# EAGLE design rc-light-controller-tlc5940-lpc812 (EAGLE 6.5.0)
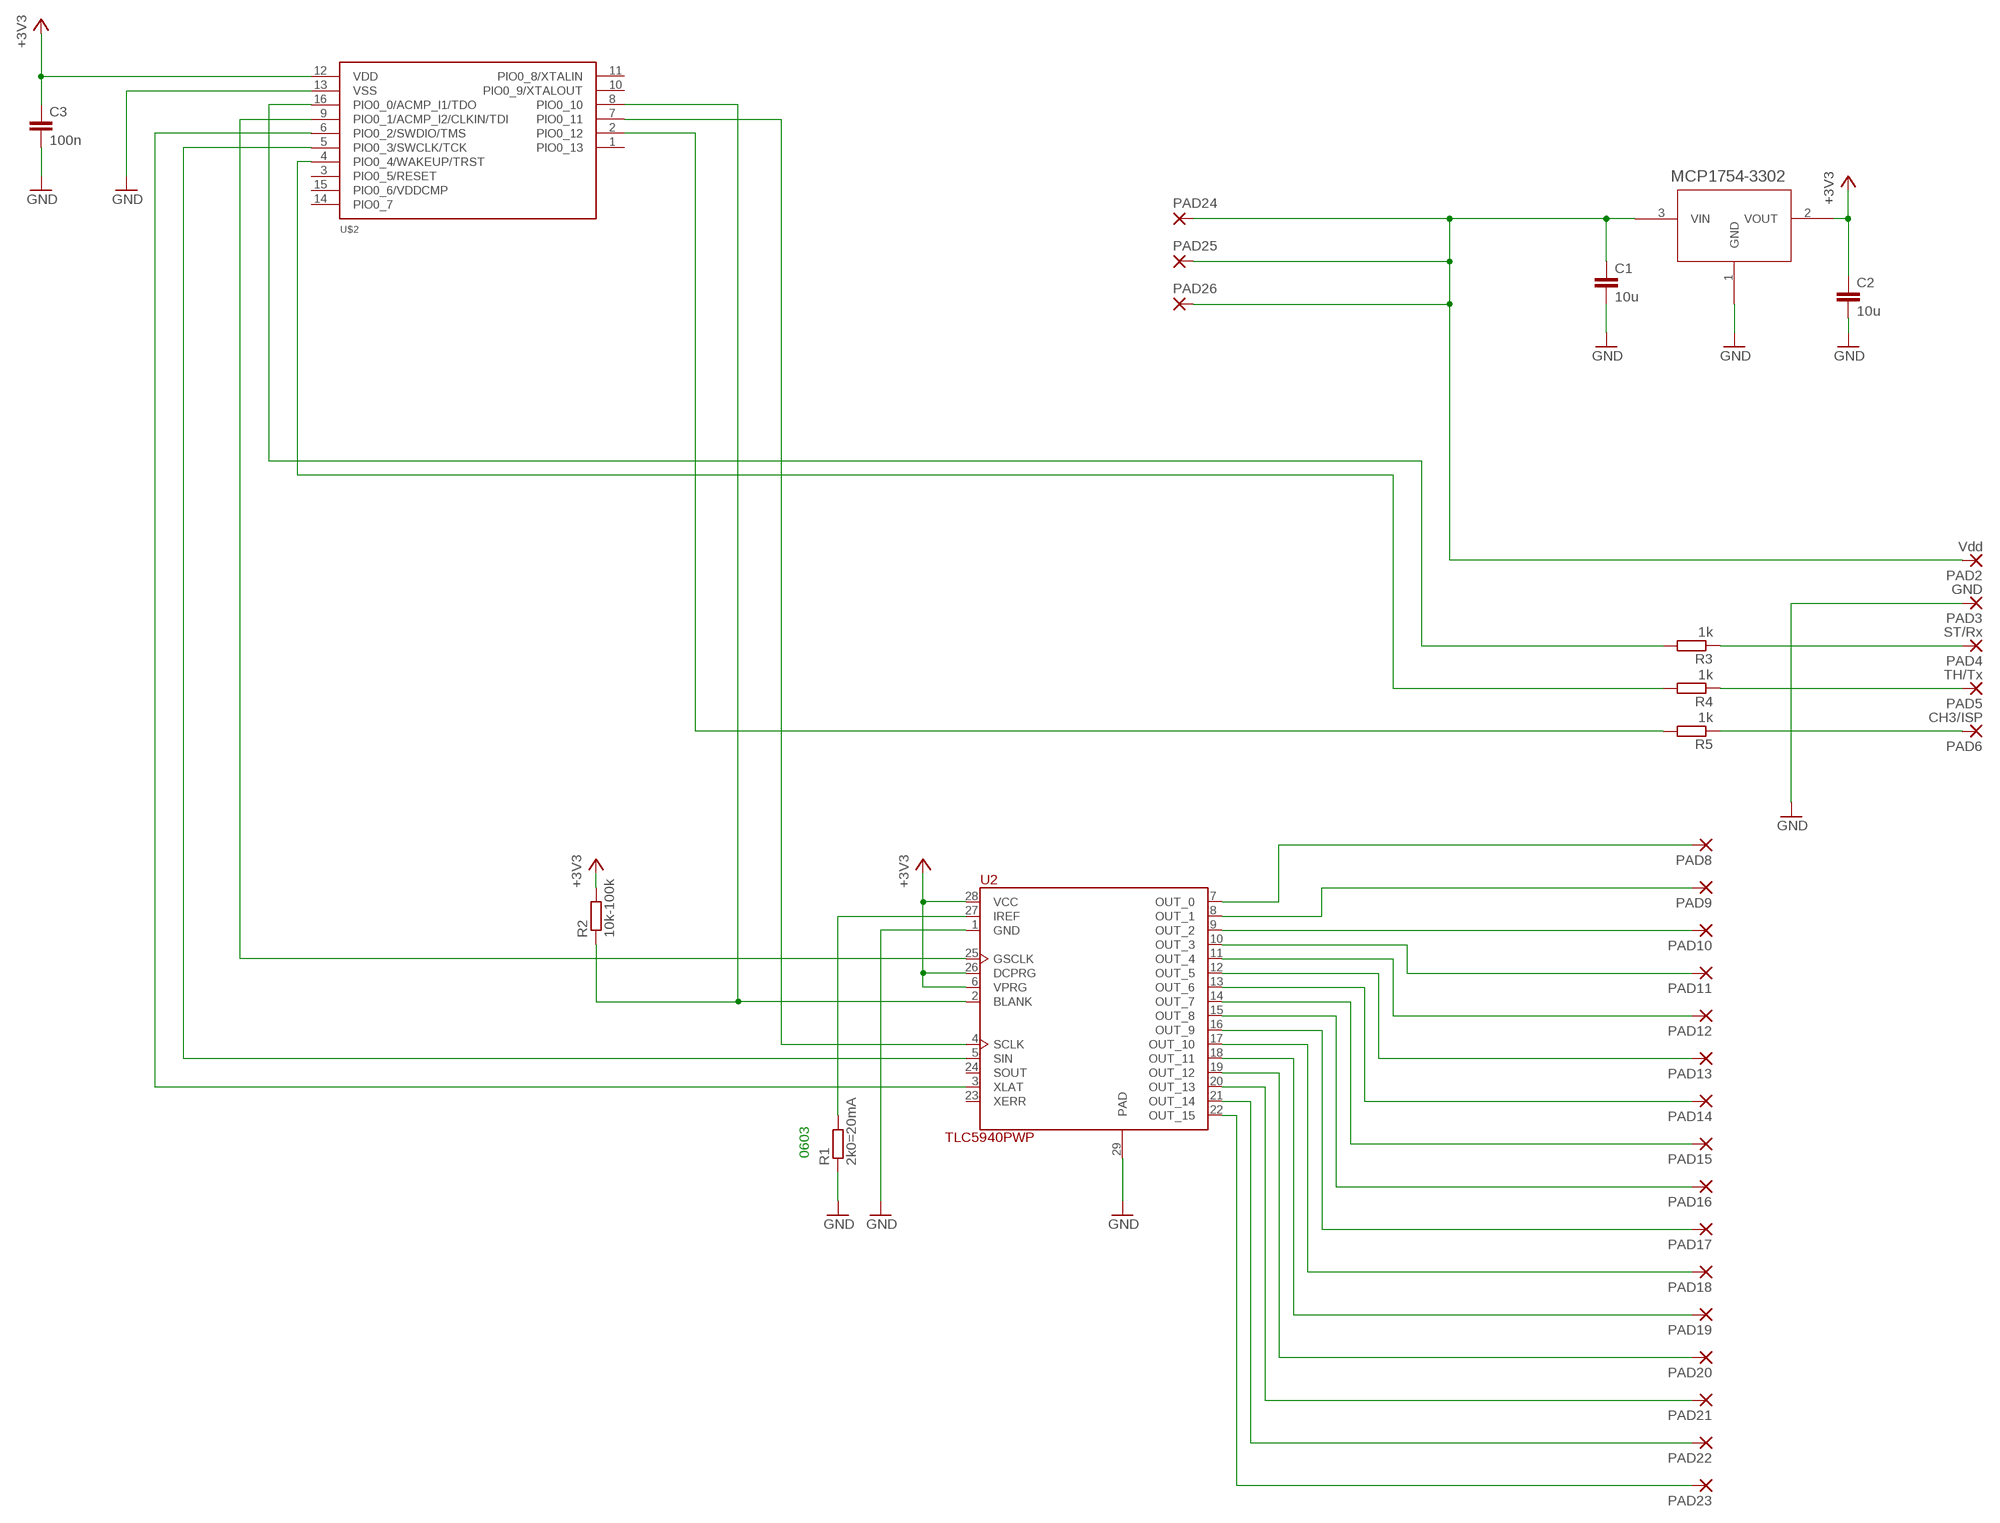
[diagram p0: schematic, sheet 1]

## Parts
C1  10u  C-EUC0805  [C0805]
C2  10u  C-EUC0805  [C0805]
C3  100n  C-EUC0805  [C0805]
PAD2  Vdd  SDM80X120  [SMD80X120]
PAD3  GND  SDM80X120  [SMD80X120]
PAD4  ST/Rx  SDM80X120  [SMD80X120]
PAD5  TH/Tx  SDM80X120  [SMD80X120]
PAD6  CH3/ISP  SDM80X120  [SMD80X120]
PAD8  SMD50X100  [SMD50X100]
PAD9  SMD50X100  [SMD50X100]
PAD10  SMD50X100  [SMD50X100]
PAD11  SMD50X100  [SMD50X100]
PAD12  SMD50X100  [SMD50X100]
PAD13  SMD50X100  [SMD50X100]
PAD14  SMD50X100  [SMD50X100]
PAD15  SMD50X100  [SMD50X100]
PAD16  SMD50X100  [SMD50X100]
PAD17  SMD50X100  [SMD50X100]
PAD18  SMD50X100  [SMD50X100]
PAD19  SMD50X100  [SMD50X100]
PAD20  SMD50X100  [SMD50X100]
PAD21  SMD50X100  [SMD50X100]
PAD22  SMD50X100  [SMD50X100]
PAD23  SMD50X100  [SMD50X100]
PAD24  SMD50X100  [SMD50X100]
PAD25  SMD50X100  [SMD50X100]
PAD26  SMD50X100  [SMD50X100]
R1  2k0=20mA  R-EU_R0805  [R0805]
R2  10k-100k  R-EU_R0805  [R0805]
R3  1k  R-EU_R0805  [R0805]
R4  1k  R-EU_R0805  [R0805]
R5  1k  R-EU_R0805  [R0805]
U2  TLC5940PWP  [SOP65P640X120-29N]
U$1  MCP1754X-XXXXX/C  [SOT-23A_MC]
U$2  LPC812  LPC812M101JDH16  [TSSOP16]

## Nets
+3V3: C2.1 C3.1 R2.2 U2.6(VPRG) U2.26(DCPRG) U2.28(VCC) U$1.2(VOUT) U$2.12(VDD)
BLANK: R2.1 U2.2(BLANK) U$2.8(PIO0_10)
GND: C1.2 C2.2 C3.2 PAD3.1(P) R1.1 U2.1(GND) U2.29(PAD) U$1.1(GND) U$2.13(VSS)
GSCLK: U2.25(GSCLK) U$2.9(PIO0_1/ACMP_I2/CLKIN/TDI)
IREF: R1.2 U2.27(IREF)
N$17: PAD4.1(P) R3.1
N$18: PAD5.1(P) R4.1
N$19: PAD6.1(P) R5.1
N$20: R5.2 U$2.2(PIO0_12)
OUT0: PAD8.1(P) U2.7(OUT_0)
OUT1: PAD9.1(P) U2.8(OUT_1)
OUT2: PAD10.1(P) U2.9(OUT_2)
OUT3: PAD11.1(P) U2.10(OUT_3)
OUT4: PAD12.1(P) U2.11(OUT_4)
OUT5: PAD13.1(P) U2.12(OUT_5)
OUT6: PAD14.1(P) U2.13(OUT_6)
OUT7: PAD15.1(P) U2.14(OUT_7)
OUT8: PAD16.1(P) U2.15(OUT_8)
OUT9: PAD17.1(P) U2.16(OUT_9)
OUT10: PAD18.1(P) U2.17(OUT_10)
OUT11: PAD19.1(P) U2.18(OUT_11)
OUT12: PAD20.1(P) U2.19(OUT_12)
OUT13: PAD21.1(P) U2.20(OUT_13)
OUT14: PAD22.1(P) U2.21(OUT_14)
OUT15: PAD23.1(P) U2.22(OUT_15)
SCLK: U2.4(SCLK) U$2.7(PIO0_11)
SIN: U2.5(SIN) U$2.5(PIO0_3/SWCLK/TCK)
SLAT: U2.3(XLAT) U$2.6(PIO0_2/SWDIO/TMS)
ST/CLK/RX: R4.2 U$2.4(PIO0_4/WAKEUP/TRST)
TH/DAT/TX: R3.2 U$2.16(PIO0_0/ACMP_I1/TDO)
VIN: C1.1 PAD2.1(P) PAD24.1(P) PAD25.1(P) PAD26.1(P) U$1.3(VIN)
Unconnected: U2.23(XERR) U2.24(SOUT) U$2.1(PIO0_13) U$2.3(PIO0_5/RESET) U$2.10(PIO0_9/XTALOUT) U$2.11(PIO0_8/XTALIN) U$2.14(PIO0_7) U$2.15(PIO0_6/VDDCMP)

## Notes on the sheet
- 0603

## Library data of the parts
C1-C3 = rcl:C-EU: CAPACITOR, European symbol
PAD2-PAD6 = wirepad:SDM80X120
PAD8-PAD26 = wirepad:SMD50X100: SMD PAD
R1-R5 = rcl:R-EU_: RESISTOR, European symbol
U2 = tlc5940:TLC5940: 16 CHANNEL LED DRIVER WITH DOT CORRECTION AND GRAYSCALE PWM CONTROL; MPN: TLC5940PWP; PACKAGE: HTSSOP-28; SUPPLIER: Texas Instruments
U$1 = MCP1754:MCP1754X-XXXXX/C
U$2 = LPC800:LPC812M101JDH16

## Board
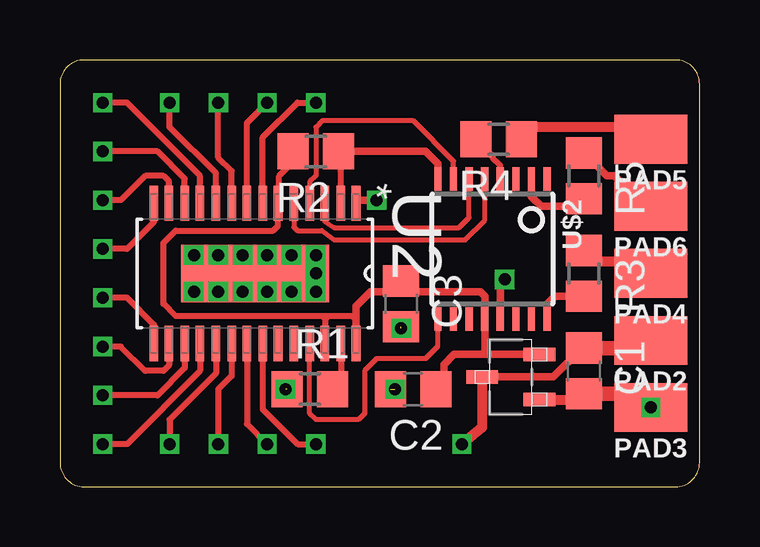
[diagram p1: board, top side]
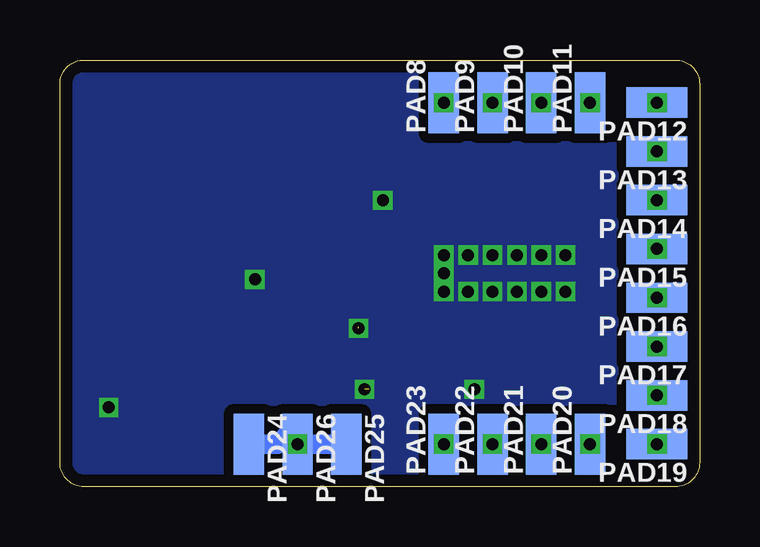
[diagram p2: board, bottom side, seen from below]

Size 26.67 x 17.78 mm. Coordinates in mm from the lower left corner, seen from the top.
Outline: 1,0 25.67,0 arc90 26.67,1 26.67,16.78 arc90 25.67,17.78 1,17.78 arc90 0,16.78 0,1 arc90 1,0
Copper layers (1*16): Top 0.035mm / dielectric 1.5mm / Bottom 0.035mm
Design rules "smart-prototyping": minimum track width 7mil, minimum drill 12mil, track to track 7mil, track to pad 7mil, pad to pad 7mil, via to via 7mil, smd to smd 0mil, copper to edge 20mil, drill to drill 10mil, minimum pad ring 10mil, minimum via ring 6mil, stop-mask expansion 2mil, vias tented up to drill 25mil, thermal gap 10mil

### Footprints (pad centres in the part's own frame; a part is rotated, then mirrored left to right if it is on the bottom)
C0805 = smd 1.3 x 1.5: 1 -0.95,0; 2 0.95,0
SMD80X120 = smd 2.032 x 3.048: 1 0,0
SMD50X100 = smd 1.27 x 2.54: 1 0,0
R0805 = smd 1.3 x 1.5: 1 -0.95,0; 2 0.95,0
SOP65P640X120-29N = smd 1.473 x 0.356: 1 -2.921,4.216; 2 -2.921,3.581; 3 -2.921,2.921; 4 -2.921,2.286; 5 -2.921,1.626; 6 -2.921,0.965; 7 -2.921,0.33; 8 -2.921,-0.33; 9 -2.921,-0.965; 10 -2.921,-1.626; 11 -2.921,-2.286; 12 -2.921,-2.921; 13 -2.921,-3.581; 14 -2.921,-4.216; 15 2.921,-4.216; 16 2.921,-3.581; 17 2.921,-2.921; 18 2.921,-2.286; 19 2.921,-1.626; 20 2.921,-0.965; 21 2.921,-0.33; 22 2.921,0.33; 23 2.921,0.965; 24 2.921,1.626; 25 2.921,2.286; 26 2.921,2.921; 27 2.921,3.581; 28 2.921,4.216 | smd 2.388 x 6.172: 29 0,0
SOT-23A_MC = smd 0.559 x 1.321: 1 -0.94,-1.194; 2 0.94,-1.194; 3 0,1.194
TSSOP16 = smd 0.305 x 0.991: 1 -2.275,-2.918; 2 -1.625,-2.918; 3 -0.975,-2.918; 4 -0.325,-2.918; 5 0.325,-2.918; 6 0.975,-2.918; 7 1.625,-2.918; 8 2.275,-2.918; 9 2.275,2.918; 10 1.625,2.918; 11 0.975,2.918; 12 0.325,2.918; 13 -0.325,2.918; 14 -0.975,2.918; 15 -1.625,2.918; 16 -2.275,2.918

### Placement (x,y rotation side)
C1  21.84,4.83 270 top
C2  14.73,4.06 180 top
C3  14.22,7.62 270 top
PAD2  24.64,6.1 90 top
PAD3  24.64,3.3 90 top
PAD4  24.64,8.89 90 top
PAD5  24.64,14.48 90 top
PAD6  24.64,11.68 90 top
PAD8  10.67,16 0 bottom
PAD9  8.64,16 0 bottom
PAD10  6.6,16 0 bottom
PAD11  4.57,16 0 bottom
PAD12  1.78,16 90 bottom
PAD13  1.78,13.97 90 bottom
PAD14  1.78,11.94 90 bottom
PAD15  1.78,9.91 90 bottom
PAD16  1.78,7.87 90 bottom
PAD17  1.78,5.84 90 bottom
PAD18  1.78,3.81 90 bottom
PAD19  1.78,1.78 90 bottom
PAD20  4.57,1.78 0 bottom
PAD21  6.6,1.78 0 bottom
PAD22  8.64,1.78 0 bottom
PAD23  10.67,1.78 0 bottom
PAD24  18.8,1.78 180 bottom
PAD25  14.73,1.78 180 bottom
PAD26  16.76,1.78 180 bottom
R1  10.41,4.06 0 top
R2  10.67,13.97 180 top
R3  21.84,8.89 270 top
R4  18.29,14.48 180 top
R5  21.84,12.95 270 top
U2  8.13,8.89 270 top
U$1  18.8,4.57 90 top
U$2  18.03,9.91 180 top

### Tracks (layer width: path | path; a pad name or v marks a point on that pad's centre or on a via)
+3V3
  Top 0.254: U2.28 12.34,6.96 12.19,7.11 11.18,7.11 | 11.18,7.11 11.05,6.99 U2.26 | 11.18,7.11 4.83,7.11 4.32,7.62 4.32,10.16 4.83,10.67 8.89,10.67 9.09,10.87 U2.6 9.14,11.86 9.14,12.95 9.97,13.78 R2.2
  Top 0.305: 13.78,8.13 12.95,8.13 12.34,7.52 U2.28 | U$1.2 17.78,5.51 | 17.78,5.51 16.43,5.51 16,5.08 16,4.38 C2.1 | 17.78,5.51 17.71,5.58 U$2.12 17.71,7.95 17.53,8.13 13.78,8.13 | 13.78,8.13 C3.1
BLANK
  Top 0.254: U2.2 11.71,13.42 R2.1
  Top 0.305: U$2.8 15.76,13.45 15.24,13.97 R2.1
GND  (via drill 0.5)  (3 unrouted)
  Top 0.305: U2.1 12.47,11.94 v13.21,11.94 | U$2.13 18.36,8.45 v18.54,8.64 | v7.62,8.13 8.13,8.64 U2.29
  Top 0.406: U$1.1 21.83,3.63 C1.2
  Top 0.61: C1.2 24.06,3.88 PAD3.1
  Top 0.813: 24.32,3.62 PAD3.1
  other vias: 24.64,3.3 8.64,9.65 9.65,9.65 5.59,9.65 6.6,9.65 9.4,4.06 13.97,4.06 14.22,6.6 7.62,9.65 10.67,9.65 10.67,8.89 10.67,8.13 9.65,8.13 8.64,8.13 6.6,8.13 5.59,8.13
  pour Bottom (isolate 0.406): 0,17.78 26.67,17.78 26.67,0 0,0
GSCLK
  Top 0.203: U$2.9 15.75,5.96 15.75,5.84 15.24,5.33 13.21,5.33 12.7,4.83 12.7,3.05 12.45,2.79 10.67,2.79 10.41,3.05 U2.25
IREF
  Top 0.254: U2.27 11.71,4.11 R1.2
N$17
  Top 0.305: R3.1 22.29,9.4 | 24.38,9.4 24.64,9.14 PAD4.1
  Top 0.406: 22.29,9.4 24.38,9.4
N$18
  Top 0.254: 19.49,14.99 R4.1
  Top 0.305: 24.38,14.99 PAD5.1
  Top 0.406: 24.38,14.99 19.49,14.99
N$19
  Top 0.305: R5.1 22.79,12.95 23.11,12.95 24.38,11.68 PAD6.1
  Top 0.813: 24.57,11.75 PAD6.1
N$20
  Top 0.305: U$2.2 19.66,12.09 20.07,11.68 21.52,11.68 R5.2
OUT0  (via drill 0.5)
  Top 0.254: U2.7 8.46,14.55 9.91,16 PAD8.1
  other vias: 10.67,16
OUT1  (via drill 0.5)
  Top 0.254: U2.8 7.8,15.16 PAD9.1
  other vias: 8.64,16
OUT2  (via drill 0.5)
  Top 0.254: U2.9 7.16,13.16 6.6,13.72 PAD10.1
  other vias: 6.6,16
OUT3  (via drill 0.5)
  Top 0.254: U2.10 6.5,13.06 4.57,14.99 PAD11.1
  other vias: 4.57,16
OUT4  (via drill 0.5)
  Top 0.254: U2.11 5.84,12.95 2.79,16 PAD12.1
  other vias: 1.78,16
OUT5  (via drill 0.5)
  Top 0.254: U2.12 5.21,12.83 4.06,13.97 PAD13.1
  other vias: 1.78,13.97
OUT6  (via drill 0.5)
  Top 0.254: U2.13 4.55,12.72 4.32,12.95 3.56,12.95 2.54,11.94 PAD14.1
  other vias: 1.78,11.94
OUT7  (via drill 0.5)
  Top 0.254: U2.14 3.91,11.02 2.79,9.91 PAD15.1
  other vias: 1.78,9.91
OUT8  (via drill 0.5)
  Top 0.254: U2.15 3.91,6.76 2.79,7.87 PAD16.1
  other vias: 1.78,7.87
OUT9  (via drill 0.5)
  Top 0.254: U2.16 4.55,5.05 4.32,4.83 3.56,4.83 2.54,5.84 PAD17.1
  other vias: 1.78,5.84
OUT10  (via drill 0.5)
  Top 0.254: U2.17 5.21,4.95 4.06,3.81 PAD18.1
  other vias: 1.78,3.81
OUT11  (via drill 0.5)
  Top 0.254: U2.18 5.84,4.83 2.79,1.78 PAD19.1
  other vias: 1.78,1.78
OUT12  (via drill 0.5)
  Top 0.254: U2.19 6.5,4.72 4.57,2.79 PAD20.1
  other vias: 4.57,1.78
OUT13  (via drill 0.5)
  Top 0.254: U2.20 7.16,4.62 6.6,4.06 PAD21.1
  other vias: 6.6,1.78
OUT14  (via drill 0.5)
  Top 0.254: U2.21 7.8,2.62 PAD22.1
  other vias: 8.64,1.78
OUT15  (via drill 0.5)
  Top 0.254: U2.22 8.46,3.23 9.91,1.78 PAD23.1
  other vias: 10.67,1.78
SCLK
  Top 0.203: U$2.7 16.41,13.56 14.73,15.24 10.92,15.24 10.67,14.99 10.67,12.95 10.41,12.7 U2.4
SIN
  Top 0.203: U2.5 9.75,10.82 9.91,10.67 10.92,10.67 11.43,10.29 16.89,10.29 17.71,11.11 U$2.5
SLAT
  Top 0.203: U2.3 11.05,11.05 11.43,10.79 16.64,10.79 17.06,11.22 U$2.6
ST/CLK/RX
  Top 0.254: U$2.4 18.36,13.39 18.03,13.72 18.03,13.78 R4.2
TH/DAT/TX
  Top 0.305: U$2.16 20.31,7.61 20.64,7.94 R3.2
VIN  (via drill 0.5)
  Top 0.305: U$1.3 20.57,4.57 21.78,5.78 C1.1
  Top 0.406: U$1.3 17.6,2.46 PAD26.1
  Top 0.61: C1.1 24.32,5.78 PAD2.1
  Bottom 0.813: PAD25.1 PAD26.1 17.14,2.15 17.22,2.15 17.59,1.78 PAD24.1
  other vias: 16.76,1.78

### Text on the board
tValues: * | *